# Altium schematic sheet optocouplers2.SchDoc
size A4; SheetNumber: 6; SheetTotal: 8
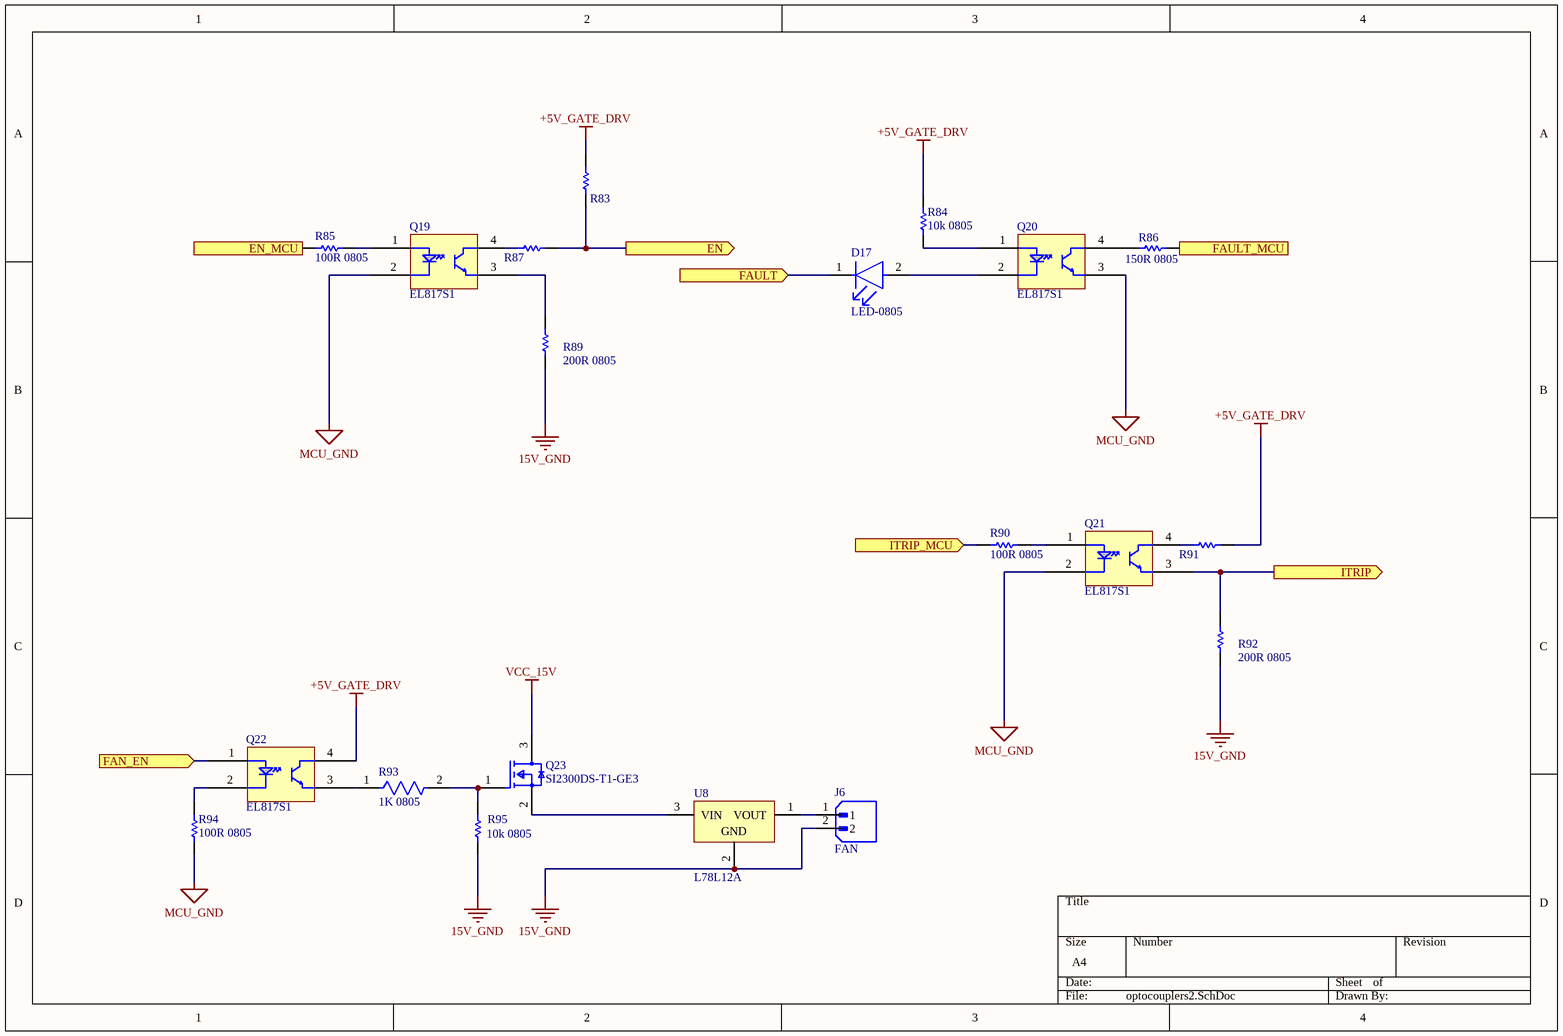
[diagram p0: optocouplers2.SchDoc]

## Parts
D17  LED-0805  [LED0805]
J6  FAN  [XH2.5-2p]
Q19  EL817S1  [EL817S1]
Q20  EL817S1  [EL817S1]
Q21  EL817S1  [EL817S1]
Q22  EL817S1  [EL817S1]
Q23  SI2300DS-T1-GE3  [FP-S-03946-MFG]
R83  0R 0603  [R0603]  (value not drawn)
R84  10k 0805  [R0805]
R85  100R 0805  [R0805]
R86  150R 0805  [R0805]
R87  0R 0603  [R0603]  (value not drawn)
R89  200R 0805  [R0805]
R90  100R 0805  [R0805]
R91  0R 0603  [R0603]  (value not drawn)
R92  200R 0805  [R0805]
R93  1K 0805  [R0805]
R94  100R 0805  [R0805]
R95  10k 0805  [R0805]
U8  L78L12A  [SOT-89_L]

## Ports
EN (out), EN_MCU (in), FAN_EN (in), FAULT (in), FAULT_MCU (out), ITRIP (out), ITRIP_MCU (in)

## Nets
15V_GND: J6.2 R89.1 R92.1 R95.1 U8.2(GND)
+5V_GATE_DRV: Q22.4(C) R83.2 R84.2 R91.2
MCU_GND: Q19.2(K) Q20.3(E) Q21.2(K) R94.1
VCC_15V: Q23.3(D)
EN: R83.1 R87.2 ; port EN
EN_MCU: R85.1 ; port EN_MCU
FAN_EN: Q22.1(A) ; port FAN_EN
FAULT: D17.1(C) ; port FAULT
FAULT_MCU: R86.2 ; port FAULT_MCU
ITRIP: Q21.3(E) R92.2 ; port ITRIP
ITRIP_MCU: R90.1 ; port ITRIP_MCU
NetD17_2: D17.2(A) Q20.2(K)
NetJ6_1: J6.1 U8.1(VOUT)
NetQ19_1: Q19.1(A) R85.2
NetQ19_3: Q19.3(E) R89.2
NetQ19_4: Q19.4(C) R87.1
NetQ20_1: Q20.1(A) R84.1
NetQ20_4: Q20.4(C) R86.1
NetQ21_1: Q21.1(A) R90.2
NetQ21_4: Q21.4(C) R91.1
NetQ22_2: Q22.2(K) R94.2
NetQ22_3: Q22.3(E) R93.1
NetQ23_1: Q23.1(G) R93.2 R95.2
NetQ23_2: Q23.2(S) U8.3(VIN)

## Library data of the parts
D17 = LED-0805: Red LED – 0805 SMD Package – 17-21SURC/S530-A3/TR8; Price per piece: 2.32; Product URL: https://sharvielectronics.com/product/red-led-0805-smd-package-17-21surc-s530-a3-tr8/; Datasheet: https://drive.google.com/file/d/193qGY45iPx2JlzACJk7ZLn2axHlG04VY/view?usp=sharing
J6 = XH2.5-2p: 2 Pin JST-XH Male Straight 2515 Connector 2.54mm Pitch; Price per piece: 1.65; Product URL: https://sharvielectronics.com/product/2-pin-jst-xh-male-straight-2515-connector-2-54mm-pitch/; Datasheet: https://sharvielectronics.com/wp-content/uploads/2021/01/XH-Connector.pdf
Q19-Q22 = EL817S1: EL817S1 (B) (TU) – F Optocoupler SMD-4 Cut Tape; Product URL: https://sharvielectronics.com/product/el817s1-b-tu-f-optocoupler-smd-4-cut-tape/; Price per piece: 7.45; Datasheet: https://sharvielectronics.com/wp-content/uploads/2021/09/EL817-Optocoupler.pdf
Q23 = CMP-02550-000182-1: SI2300DS 30V 3.6A N-Channel Mosfet – SOT-23 Package; Manufacturer: Vishay; Threshold Vgs Max: 1.5V; Max Forward Diode Voltage: 1.2V; Max Junction Temp: +150°C; Reverse Recovery Time: 11ns; Depletion Mode: False; Standoff Height: 0.01mm; Gate To Source Voltage: 12V; Input Capacitace At Vds: 320pF @ 15V; Turn Off Delay Time: 15ns; Threshold Vgs Min: 0.6V; Transconductance: 13S; Gate Charge At Vgs: 6.5nC @ 10V; Power Dissipation: 1.1W; Drain To Source Resistance: 0.055Ω; Number Of N Channels: 1; Pulse Drain Current: 15A; Continuous Drain Current: 3.1A; Typ Forward Diode Voltage: 0.8V; Reverse Recovery Charge: 5nC; Rthja Max: 90°C/W; Turn On Delay Time: 5ns; Device Class L2: Transistors; Digikey Description: MOSFET N-CH 30V 3.6A SOT-23; Device Class L3: MOSFETs; ComponentLink2Description: Datasheet; Height: 1.12mm; Temperature Range Low: -55°C; Package: S-03946; Device Class L1: Discrete Semiconductors; RoHS: TRUE; ComponentLink2URL: http://www.vishay.com/docs/65701/si2300ds.pdf; Category: Trans; Drain To Source Breakdown Voltage: 30V; Automotive: No; Number Of Channels: 1; Mouser Description: MOSFET 30V 3.6A N-CH MOSFET; Temperature: -55°C to +150°C; Manufacturer Part Number: SI2300DS-T1-GE3; Octopart: https://octopart.com/si2300ds-t1-ge3-vishay-44451512; Drain To Source Voltage: 30V; Lead Free: Yes; Temperature Range High: +150°C; Ipc Land Pattern Name: SOT95P237X100-3; Price per piece: 12.5; Product URL: https://sharvielectronics.com/product/si2300ds-30v-3-6a-n-channel-mosfet-sot-23-package/; Datasheet: https://www.vishay.com/docs/65701/si2300ds.pdf
R83 R87 R91 = R0000 0603: 0 Ohm 1/10 Watt Resistor 1% Tolerance RC0603FR-070RL – 0603 Package; Price per piece: 0.97; Product URL: https://sharvielectronics.com/product/0-ohm-1-10-watt-resistor-1-tolerance-rc0603fr-070rl-0603-package/; Datasheet: https://drive.google.com/file/d/1pkLQT_RQ1i35oFQcGREpZr7Oy3Ppi-ZT/view?usp=sharing
R84 R95 = 10k 0805: 10K Ohm 1/8 Watt Resistor 1% Tolerance RC0805FR-0710KL – 0805 Package; Price per piece: 0.82; Product URL: https://sharvielectronics.com/product/10k-ohm-1-8-watt-resistor-1-tolerance-rc0805fr-0710kl-0805-package/; Datasheet: https://drive.google.com/file/d/1pkLQT_RQ1i35oFQcGREpZr7Oy3Ppi-ZT/view?usp=sharing
R85 R90 R94 = 100R 0805: 100 ohm 1/4W Resistor 0805 Package; Price per piece: 0.82; Product URL: https://sharvielectronics.com/product/100-ohm-1-4w-resistor-0805-package/; Datasheet: *
R86 = R0805: 510 Ohm 1/8 Watt Resistor 1% Tolerance 0805S8F5100T5E – 0805 Package; Price per piece: 0.85; Product URL: https://sharvielectronics.com/product/510-ohm-1-8-watt-resistor-1-tolerance-0805s8f5100t5e-0805-package/; Datasheet: https://drive.google.com/file/d/1rtx85iFJaMrDbsv7PAzG9bTFItPmAE38/view
R89 R92 = R0805: 200 Ohm 1/8 Watt Resistor 1% Tolerance 0805W8F2000TE – 0805 Package; Price per piece: 0.82; Product URL: https://sharvielectronics.com/product/200-ohm-1-8-watt-resistor-1-tolerance-0805w8f2000te-0805-package/; Datasheet: https://drive.google.com/file/d/1rtx85iFJaMrDbsv7PAzG9bTFItPmAE38/view?usp=sharing
R93 = 1k 0805: 1K Ohm 1/8 Watt Resistor 1% Tolerance 0805S8F1001T5E – 0805 Package; Price per piece: 0.82; Product URL: https://sharvielectronics.com/product/1k-ohm-1-8-watt-resistor-1-tolerance-0805s8f1001t5e-0805-package/; Datasheet: https://drive.google.com/file/d/1rtx85iFJaMrDbsv7PAzG9bTFItPmAE38/view?usp=sharing
U8 = CMP-0244-00387-1: 78L12 – 12V 150mA Positive Voltage Regulator-SOT-89 Package; DatasheetVersion: 1/02/2011; PackageDescription: 3-Pin SOT-89 Package 1.5 mm Pitch, 4.1 mm Lead Span; ComponentLink2Description: Datasheet; ComponentLink1Description: Manufacturer URL; PackageVersion: 2011; PackageReference: SOT-89; ComponentLink1URL: http://www.st.com; ComponentLink2URL: http://www.st.com/internet/com/TECHNICAL_RESOURCES/TECHNICAL_LITERATURE/DATASHEET/CD00000446.pdf; Price per piece: 13.32; Product URL: https://sharvielectronics.com/product/78l12-12v-150ma-positive-voltage-regulator-sot-89-package/; Datasheet: https://drive.google.com/file/d/1zOSy_FqMAdv1iXKmyJwn0G3RjMYeVW2a/view?usp=sharing